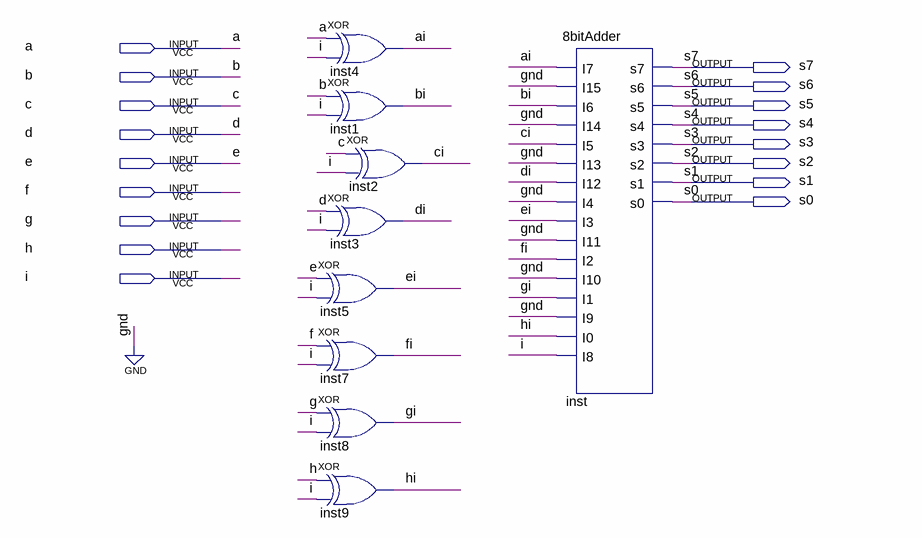
[diagram p0: schematic sheet]
// Quartus schematic Comp2Big.bdf as structural Verilog: 9 symbols, 17 pins
module Comp2Big (
  input  a,
  input  b,
  input  c,
  input  d,
  input  e,
  input  f,
  input  g,
  input  h,
  input  i,
  output s7,
  output s6,
  output s5,
  output s4,
  output s3,
  output s2,
  output s1,
  output s0
);

  wire ai, bi, ci, di, ei, fi, gi, hi;

  xor inst4 (ai, a, i);
  xor inst1 (bi, b, i);
  xor inst2 (ci, c, i);
  xor inst3 (di, d, i);
  xor inst5 (ei, e, i);
  xor inst7 (fi, f, i);
  xor inst8 (gi, g, i);
  xor inst9 (hi, h, i);
  \8bitAdder  inst (
    .I7(ai), .I15(1'b0), .I6(bi), .I14(1'b0), .I5(ci), .I13(1'b0), .I12(di), .I4(1'b0), .I3(ei), .I11(1'b0),
    .I2(fi), .I10(1'b0), .I1(gi), .I9(1'b0), .I0(hi), .I8(i), .s7(s7), .s6(s6), .s5(s5), .s4(s4), .s3(s3),
    .s2(s2), .s1(s1), .s0(s0));
endmodule
